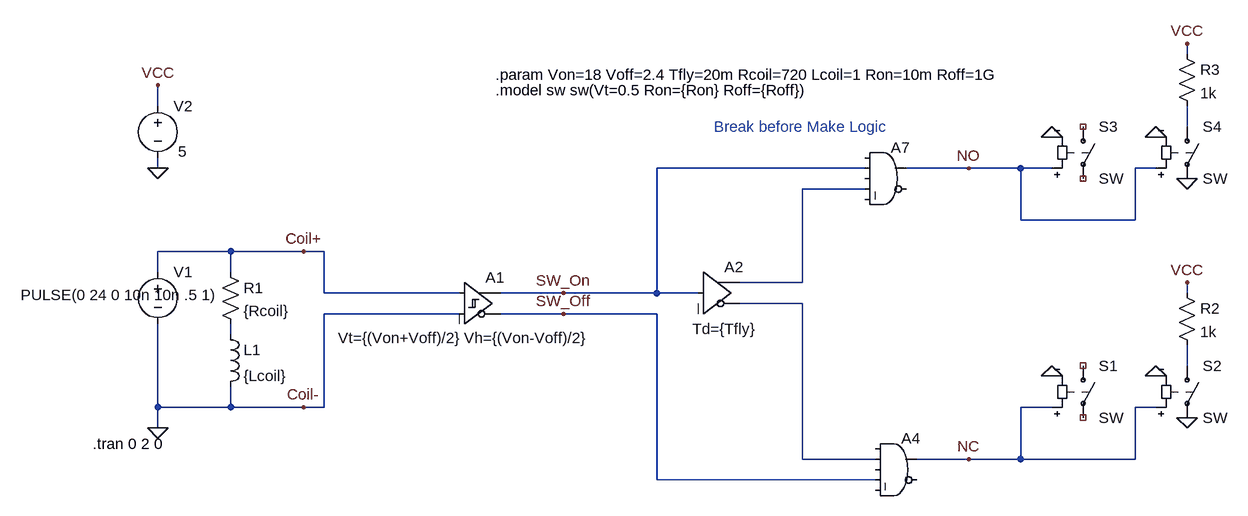
[diagram p0: schematic Relay_SR4D.asc]
Relay_SR4D.asc, the LTspice schematic file:
Version 4
SHEET 1 1392 776
WIRE 1216 -240 1216 -256
WIRE -368 -160 -368 -192
WIRE 1216 -128 1216 -160
WIRE -368 -64 -368 -80
WIRE 720 -64 400 -64
WIRE 880 -64 784 -64
WIRE 960 -64 880 -64
WIRE 1008 -64 960 -64
WIRE 1168 -64 1136 -64
WIRE 720 -32 624 -32
WIRE 960 16 960 -64
WIRE 1136 16 1136 -64
WIRE 1136 16 960 16
WIRE -256 64 -368 64
WIRE -144 64 -256 64
WIRE -112 64 -144 64
WIRE -368 96 -368 64
WIRE -256 96 -256 64
WIRE 624 112 624 -32
WIRE 624 112 528 112
WIRE -112 128 -112 64
WIRE 96 128 -112 128
WIRE 256 128 160 128
WIRE 400 128 400 -64
WIRE 400 128 256 128
WIRE 464 128 400 128
WIRE 1216 128 1216 112
WIRE 624 144 528 144
WIRE 96 160 -112 160
WIRE 256 160 160 160
WIRE 400 160 256 160
WIRE -256 192 -256 176
WIRE 1216 240 1216 208
WIRE -368 304 -368 176
WIRE -256 304 -256 272
WIRE -256 304 -368 304
WIRE -144 304 -256 304
WIRE -112 304 -112 160
WIRE -112 304 -144 304
WIRE 1008 304 960 304
WIRE 1168 304 1136 304
WIRE -368 336 -368 304
WIRE 624 384 624 144
WIRE 736 384 624 384
WIRE 880 384 800 384
WIRE 960 384 960 304
WIRE 960 384 880 384
WIRE 1136 384 1136 304
WIRE 1136 384 960 384
WIRE 400 416 400 160
WIRE 736 416 400 416
FLAG -368 336 0
FLAG -144 64 Coil+
FLAG -144 304 Coil-
FLAG 256 128 SW_On
FLAG 256 160 SW_Off
FLAG 880 384 NC
FLAG 880 -64 NO
FLAG 1008 256 0
FLAG 1168 256 0
FLAG 1216 320 0
FLAG -368 -64 0
FLAG -368 -192 VCC
FLAG 1216 112 VCC
FLAG 1008 -112 0
FLAG 1168 -112 0
FLAG 1216 -48 0
FLAG 1216 -256 VCC
SYMBOL Digital\\diffschmitt 96 80 R0
WINDOW 3 -187 117 Left 2
SYMATTR InstName A1
SYMATTR Value Vt={(Von+Voff)/2} Vh={(Von-Voff)/2}
SYMBOL voltage -368 80 R0
WINDOW 3 -211 51 Left 2
WINDOW 123 0 0 Left 0
WINDOW 39 0 0 Left 0
SYMATTR InstName V1
SYMATTR Value PULSE(0 24 0 10n 10n .5 1)
SYMBOL Digital\\buf 464 64 R0
WINDOW 3 -9 119 Left 2
SYMATTR InstName A2
SYMATTR Value Td={Tfly}
SYMBOL Digital\\and 768 336 R0
SYMATTR InstName A4
SYMBOL res -272 80 R0
SYMATTR InstName R1
SYMATTR Value {Rcoil}
SYMBOL Digital\\and 752 -112 R0
SYMATTR InstName A7
SYMBOL sw 1056 224 R0
SYMATTR InstName S1
SYMBOL sw 1216 224 R0
SYMATTR InstName S2
SYMBOL res 1200 112 R0
SYMATTR InstName R2
SYMATTR Value 1k
SYMBOL voltage -368 -176 R0
WINDOW 3 31 86 Left 2
WINDOW 123 0 0 Left 0
WINDOW 39 0 0 Left 0
SYMATTR InstName V2
SYMATTR Value 5
SYMBOL sw 1056 -144 R0
SYMATTR InstName S3
SYMBOL sw 1216 -144 R0
SYMATTR InstName S4
SYMBOL res 1200 -256 R0
SYMATTR InstName R3
SYMATTR Value 1k
SYMBOL ind -272 176 R0
SYMATTR InstName L1
SYMATTR Value {Lcoil}
TEXT -468 360 Left 2 !.tran 0 2 0
TEXT 152 -208 Left 2 !.param Von=18 Voff=2.4 Tfly=20m Rcoil=720 Lcoil=1 Ron=10m Roff=1G
TEXT 152 -184 Left 2 !.model sw sw(Vt=0.5 Ron={Ron} Roff={Roff})
TEXT 488 -128 Left 2 ;Break before Make Logic

The netlist it stands for:
* Relay_SR4D.asc
A1 Coil+ 0 0 0 0 SW_Off SW_On 0 SCHMITT Vt={(Von+Voff)/2} Vh={(Von-Voff)/2}
V1 Coil+ 0 PULSE(0 24 0 10n 10n .5 1)
A2 SW_On 0 0 0 0 N003 N002 0 BUF Td={Tfly}
A4 0 N003 0 SW_Off 0 0 NC 0 AND
R1 Coil+ N004 {Rcoil}
A7 0 SW_On 0 N002 0 0 NO 0 AND
S1 NC_01 NC_02 NC 0 SW
S2 N005 0 NC 0 SW
R2 VCC N005 1k
V2 VCC 0 5
S3 NC_03 NC_04 NO 0 SW
S4 N001 0 NO 0 SW
R3 VCC N001 1k
L1 N004 0 {Lcoil}
.tran 0 2 0
.param Von=18 Voff=2.4 Tfly=20m Rcoil=720 Lcoil=1 Ron=10m Roff=1G
.model sw sw(Vt=0.5 Ron={Ron} Roff={Roff})
* Break before Make Logic
.backanno
.end